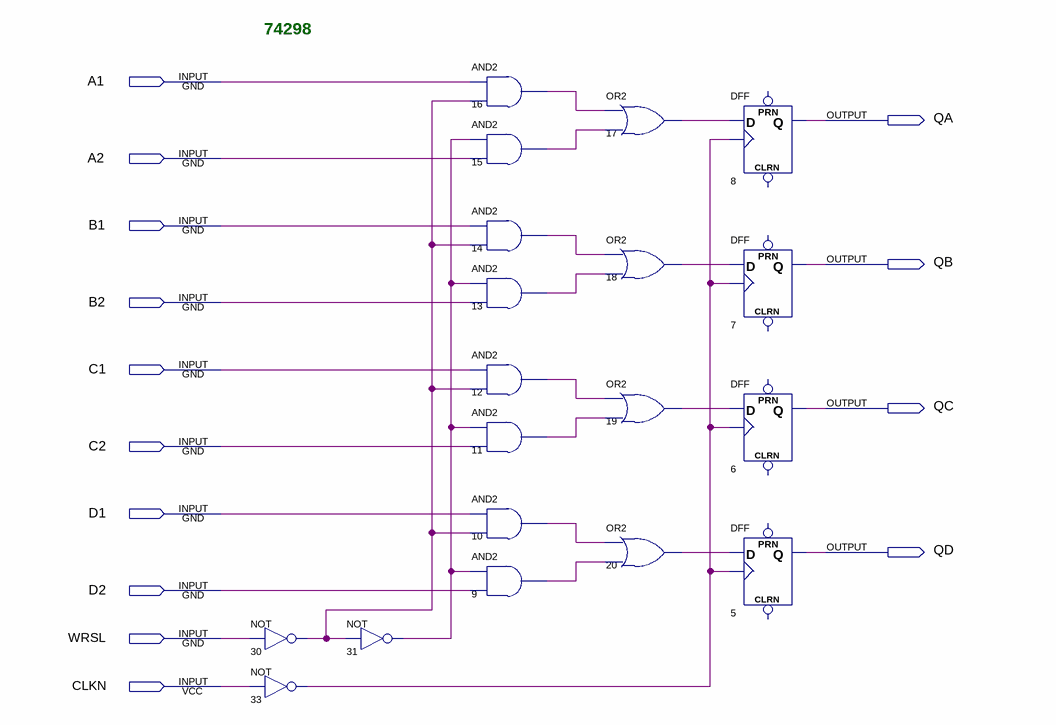
[diagram p0: schematic sheet]
// Quartus schematic 74298.bdf as structural Verilog: 19 symbols, 14 pins
module \74298  (
  input  A1,
  input  A2,
  input  B1,
  input  B2,
  input  C1,
  input  C2,
  input  D1,
  input  D2,
  input  WRSL,
  input  CLKN,
  output QA,
  output QB,
  output QC,
  output QD
);

  wire n9_out, n10_out, n11_out, n12_out, n13_out, n14_out, n15_out, n16_out, n17_out, n18_out, n19_out,
       n20_out, n30_out, n31_out, n33_out;

  not u_30 (n30_out, WRSL);
  not u_33 (n33_out, CLKN);
  not u_31 (n31_out, n30_out);
  and u_16 (n16_out, A1, n30_out);
  and u_15 (n15_out, n31_out, A2);
  and u_14 (n14_out, B1, n30_out);
  and u_13 (n13_out, n31_out, B2);
  and u_12 (n12_out, C1, n30_out);
  and u_11 (n11_out, n31_out, C2);
  and u_10 (n10_out, D1, n30_out);
  and u_9 (n9_out, n31_out, D2);
  or u_17 (n17_out, n16_out, n15_out);
  or u_18 (n18_out, n14_out, n13_out);
  or u_19 (n19_out, n12_out, n11_out);
  or u_20 (n20_out, n10_out, n9_out);
  DFF u_8 (.CLK(n33_out), .D(n17_out), .Q(QA));  // open: CLRN, PRN
  DFF u_7 (.CLK(n33_out), .D(n18_out), .Q(QB));  // open: CLRN, PRN
  DFF u_6 (.CLK(n33_out), .D(n19_out), .Q(QC));  // open: CLRN, PRN
  DFF u_5 (.CLK(n33_out), .D(n20_out), .Q(QD));  // open: CLRN, PRN

  // Notes on the sheet:
  //   74298
endmodule
